# Altium schematic sheet Power_Sheet.SchDoc: Power Circuit
size 420 x 297 mm; Engineer: Zain Siddiqui; Revision: V1.0; SheetNumber: 4; SheetTotal: 8
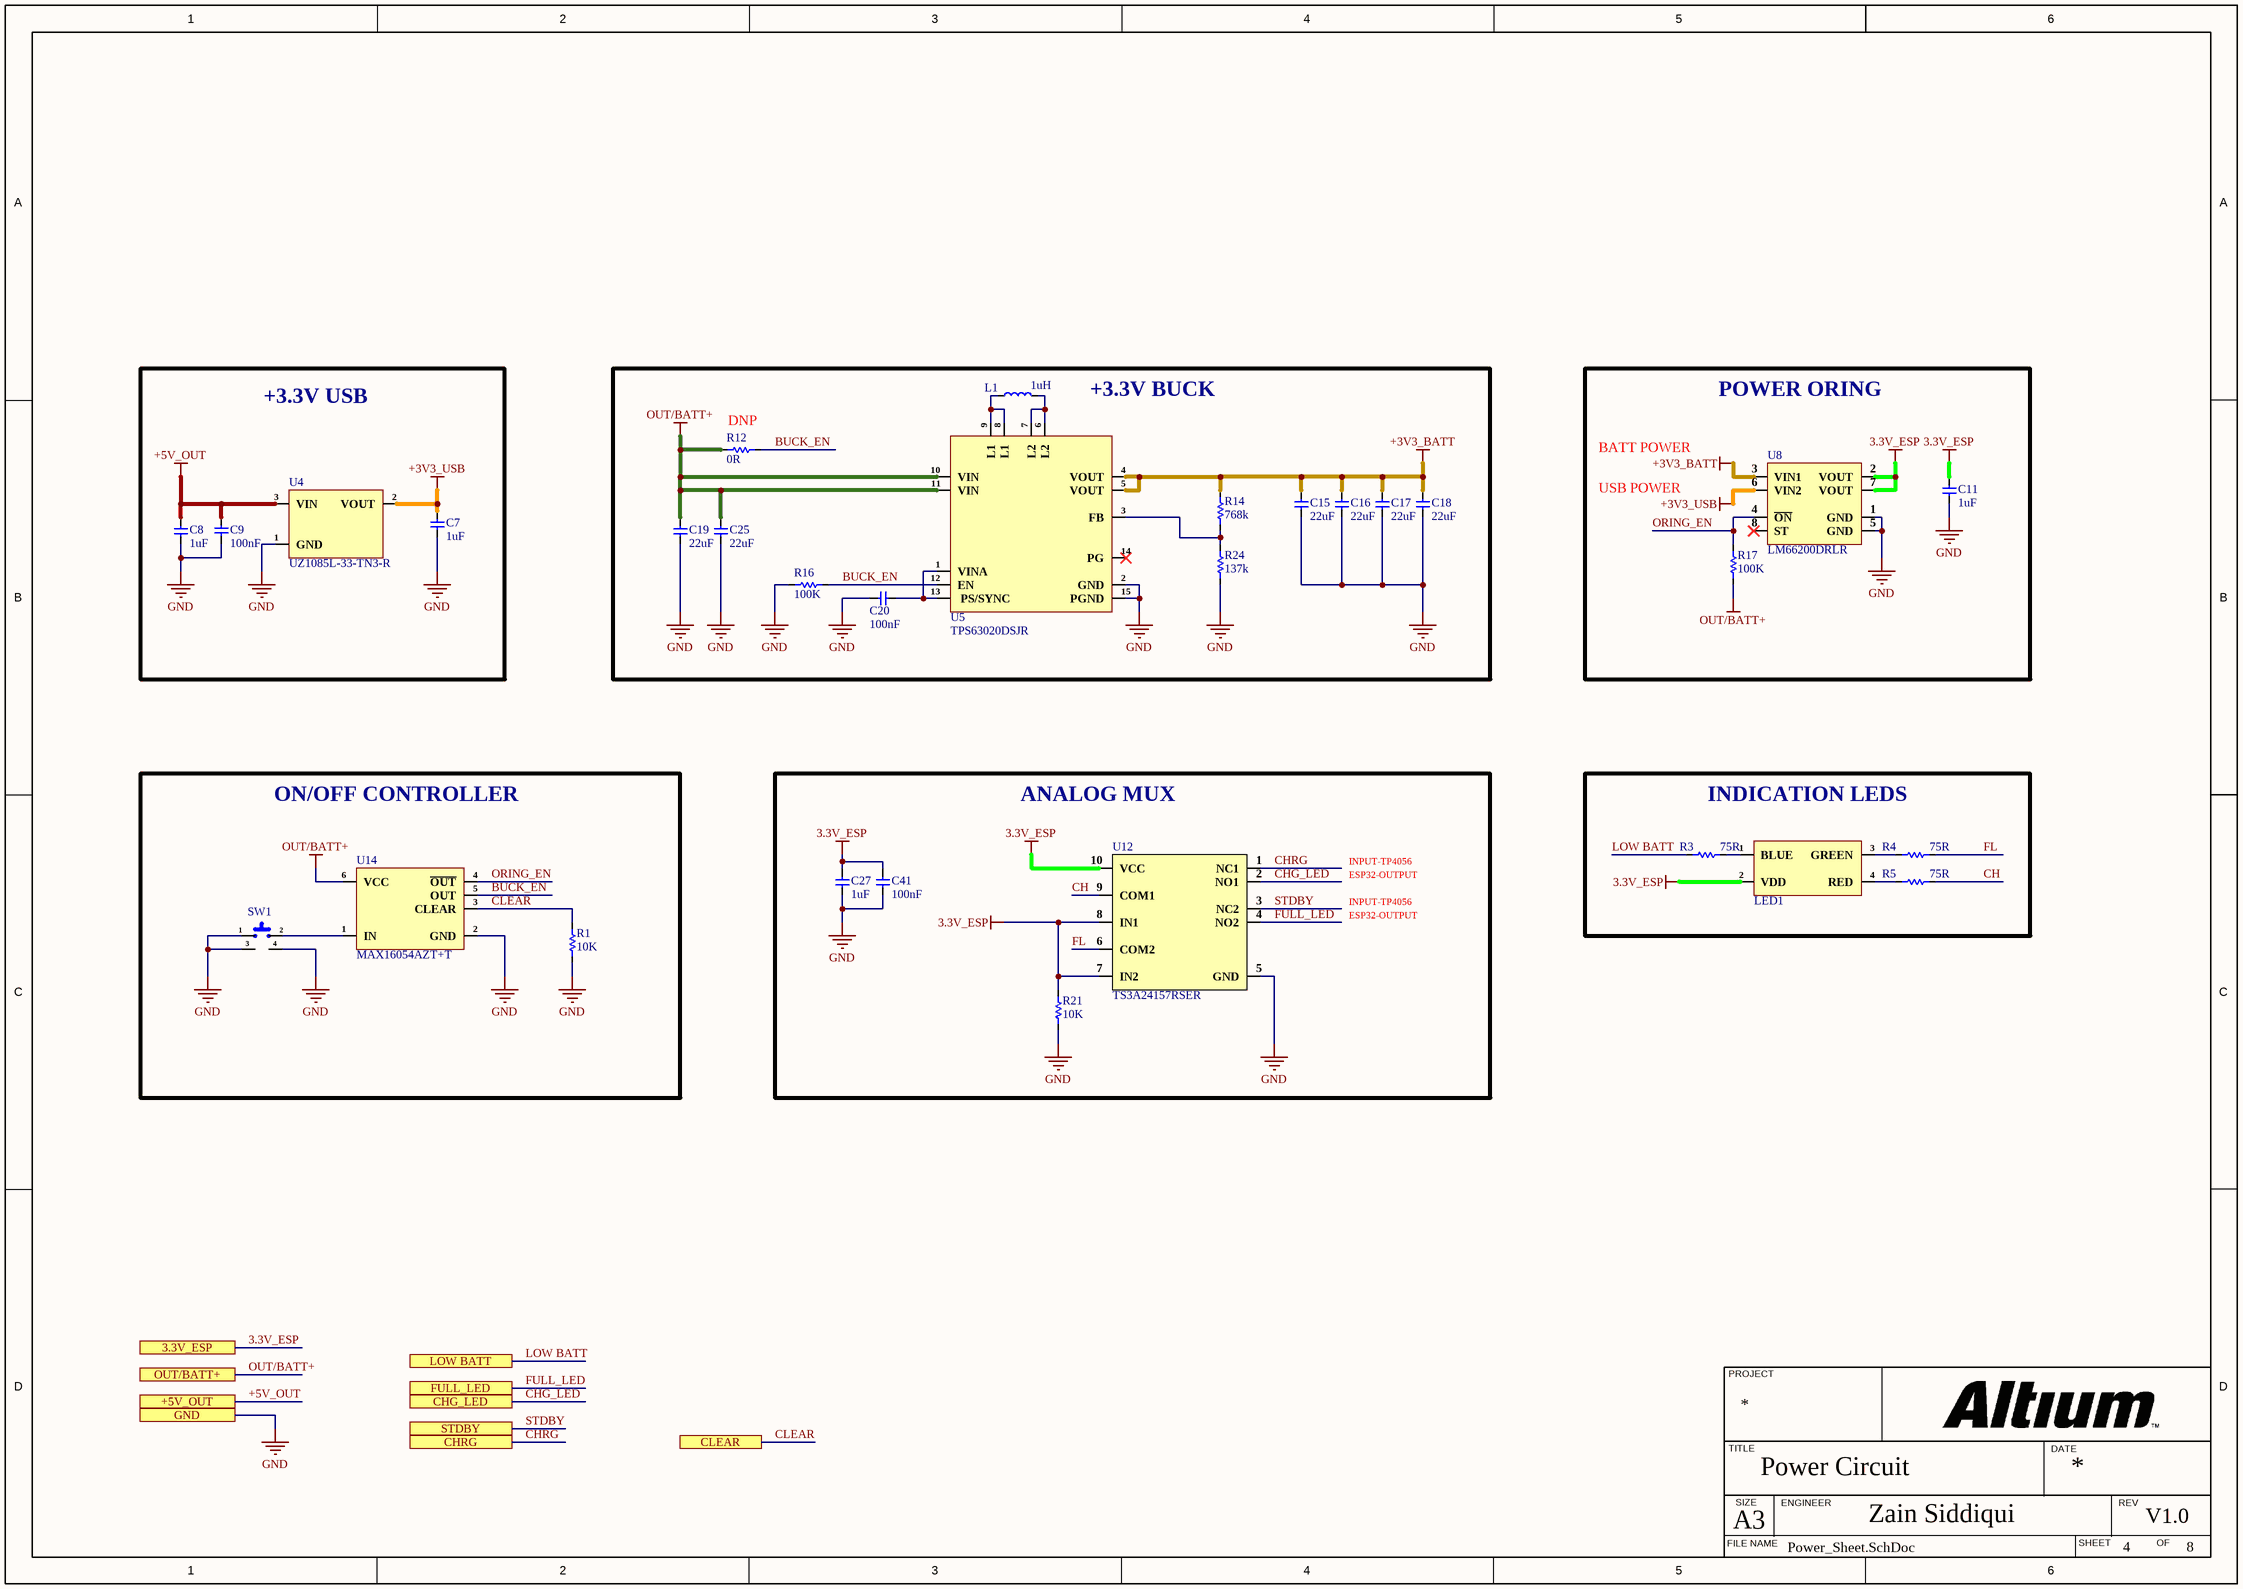
[diagram p0: Power_Sheet.SchDoc]

## Parts
C7  1uF  [Cap-0402]
C8  1uF  [Cap-0402]
C9  100nF  [cap-0402]
C11  1uF  [Cap-0402]
C15  22uF  [Cap-0805]
C16  22uF  [Cap-0805]
C17  22uF  [Cap-0805]
C18  22uF  [Cap-0805]
C19  22uF  [Cap-0805]
C20  100nF  [cap-0402]
C25  22uF  [Cap-0805]
C27  1uF  [Cap-0402]
C41  100nF  [cap-0402]
L1  1uH  [IND-1008 (2520 Metric)]
LED1  S4-3528RGBTA-A  [SMD3528-4P]  (value not drawn)
R1  10K  [Res-0402]
R3  75R  [Res-0402]
R4  75R  [Res-0402]
R5  75R  [Res-0402]
R12  0R  [Res-0402]  (no BOM)
R14  768k  [Res-0402]
R16  100K  [Res-0402]
R17  100K  [Res-0402]
R21  10K  [Res-0402]
R24  137k  [Res-0402]
SW1  TC-6615-9.5-260G  [TC-6615-9.5-260G]  (value not drawn)
U4  UZ1085L-33-TN3-R  [TO-252-2(DPAK)]
U5  TPS63020DSJR  [14-VSON (4x3)]
U8  LM66200DRLR  [SOT8]
U12  TS3A24157RSER  [UQFN-10(1.5x2)]
U14  MAX16054AZT+T  [TSOT-23-6]

## Blocks framed on the sheet
+3.3V USB: C7-C9 U4
+3.3V BUCK: C15-C20 C25 L1 R12 R14 R16 R24 U5
POWER ORING: C11 R17 U8
ON/OFF CONTROLLER: R1 SW1 U14
ANALOG MUX: C27 C41 R21 U12
INDICATION LEDS: LED1 R3-R5

## Ports
3.3V_ESP (see Top_Sheet[2B], BattCharging_Sheet[2D], Controller_Sheet[3D], Display_Sheet[1D], Ethernet_Sheet[4D], FuelGauge_Sheet[2C]), +5V_OUT (see Top_Sheet[2B], BattCharging_Sheet[2D], USB_Sheet[3C]), CHG_LED (see Top_Sheet[2B], Controller_Sheet[4D]), CHRG (see Top_Sheet[2B], BattCharging_Sheet[3D], Controller_Sheet[4D]), CLEAR (see Top_Sheet[2B], Controller_Sheet[4D]), FULL_LED (see Top_Sheet[2B], Controller_Sheet[4D]), GND (see Top_Sheet[2C], BattCharging_Sheet[2D], Controller_Sheet[3D], Display_Sheet[1D], Ethernet_Sheet[4D], FuelGauge_Sheet[2C], USB_Sheet[3C]), LOW BATT (see Top_Sheet[2C], Controller_Sheet[4D]), OUT/BATT+ (see Top_Sheet[2B], BattCharging_Sheet[2D], FuelGauge_Sheet[2C]), STDBY (see Top_Sheet[2B], BattCharging_Sheet[3D], Controller_Sheet[4D])

## Nets
3.3V_ESP: C11.2 C27.2 C41.2 LED1.2(VDD) R21.1 U8.2(VOUT) U8.7(VOUT) U12.7(IN2) U12.8(IN1) U12.10(VCC) ; port 3.3V_ESP
+3V3_BATT: C15.2 C16.2 C17.2 C18.2 R14.2 U5.4(VOUT) U5.5(VOUT) U8.3(VIN1)
+3V3_USB: C7.2 U4.2(VOUT) U8.6(VIN2)
+5V_OUT: C8.2 C9.1 U4.3(VIN) ; port +5V_OUT
GND: C7.1 C8.1 C9.2 C11.1 C15.1 C16.1 C17.1 C18.1 C19.1 C20.2 C25.1 C27.1 C41.1 R1.2 R16.1 R21.2 R24.1 SW1.1 SW1.3 SW1.4 U4.1(GND) U5.2(GND) U5.15(PGND) U8.1(GND) U8.5(GND) U12.5(GND) U14.2(GND) ; port GND
OUT/BATT+: C19.2 C25.2 R12.1 R17.1 U5.10(VIN) U5.11(VIN) U14.6(VCC) ; port OUT/BATT+
BUCK_EN: R12.2 R16.2 U5.12(EN) U14.5(OUT)
CH: R5.2 U12.9(COM1)
CHG_LED: U12.2(NO1) ; port CHG_LED
CHRG: U12.1(NC1) ; port CHRG
CLEAR: R1.1 U14.3(CLEAR) ; port CLEAR
FL: R4.2 U12.6(COM2)
FULL_LED: U12.4(NO2) ; port FULL_LED
LOW BATT: R3.1 ; port LOW BATT
ORING_EN: R17.2 U8.4(~{ON}) U14.4(~{OUT})
STDBY: U12.3(NC2) ; port STDBY
NetC20_1: C20.1 U5.1(VINA) U5.13(PS/SYNC)
NetL1_1: L1.1 U5.8(L1) U5.9(L1)
NetL1_2: L1.2 U5.6(L2) U5.7(L2)
NetLED1_1: LED1.1(BLUE) R3.2
NetLED1_3: LED1.3(GREEN) R4.1
NetLED1_4: LED1.4(RED) R5.1
NetR14_1: R14.1 R24.2 U5.3(FB)
NetSW1_2: SW1.2 U14.1(IN)

Not connected (* = marked no-connect by the designer): U5 14(PG)*; U8 8(ST)*

## Notes on the sheet
- (near R12) DNP
- BATT POWER
- USB POWER
- INPUT-TP4056
- ESP32-OUTPUT
- PROJECT
- TITLE
- DATE
- FILE NAME
- A3
- SIZE
- ENGINEER
- SHEET
- REV
- OF

## Library data of the parts
C7 = CC0402KRX5R6BB105: CAP CER 1UF 10V X5R 0402; Manufacturer: Yageo; Tolerance: 10%; Dissipation Factor: 15%; Item Type: Capacitor; Supplier 1: Mouser; Manufacturer Part Number: CC0402KRX5R6BB105; RoHS: Yes; Category: Ceramic Capacitors; Stock 1: 6711367; Pricing 1: 1=0.11000, 10=0.05500, 50=0.05500, 100=0.03300, 500=0.02700, 1000=0.02200, 2500=0.02100, 10000=0.01800 (USD); Mount: Surface Mount; Case/Package: 0402; Number of Pins: 2; Case Code (Metric): 1005; Case Code (Imperial): 0402; Min Operating Temperature: -55°C; Max Operating Temperature: 85°C; Capacitance: 1uF; Dielectric: X5R; Package Quantity: 1; Voltage Rating: 10V; Packaging: Tape and Reel; Voltage Rating (DC): 10V; Termination: SMD/SMT; Resistor Type: Ceramic; Series: CC; Construction: Flat; Length: 1mm; Width: 0.02inch; Height: 0.5mm; Thickness: 0.022inch; Depth: 0.5mm; Radiation Hardening: No; REACH SVHC: No SVHC; Lead Free: Lead Free; Halogen Free: Halogen Free; RoHS Compliant: Yes; ComponentLink1URL: https://datasheet.ciiva.com/176/upy-gphc-x5r-4v-to-50v-12-176704.pdf?src-supplier=Digi-Key; ComponentLink1Description: https://datasheet.ciiva.com/176/upy-gphc-x5r-4v-to-50v-12-176704.pdf?src-supplier=Digi-Key; ComponentLink2URL: https://datasheet.ciiva.com/176/mlccorderingcode-176705.pdf?src-supplier=Digi-Key; ComponentLink2Description: https://datasheet.ciiva.com/176/mlccorderingcode-176705.pdf?src-supplier=Digi-Key; ComponentLink3URL: https://datasheet.ciiva.com/176/mlccorderingcode-176706.pdf?src-supplier=Digi-Key; ComponentLink3Description: https://datasheet.ciiva.com/176/mlccorderingcode-176706.pdf?src-supplier=Digi-Key; Supplier Part Number 1: 603-CC402KRX5R6BB105; LCSC Part Number: C106254
C8 C11 C27 = CC0402KRX5R8BB105: CAP CER 1UF 25V X5R 0402; Manufacturer: Yageo; Tolerance: 10%; Supplier 1: Mouser; Manufacturer Part Number: CC0402KRX5R8BB105; RoHS: Yes; Category: Ceramic Capacitors; Stock 1: 91975; Pricing 1: 1=0.30000, 10=0.20400, 50=0.20400, 100=0.11600, 1000=0.07200, 10000=0.05900 (USD); Mount: Surface Mount; Case/Package: 0402; Case Code (Metric): 1005; Case Code (Imperial): 0402; Weight: 2.3E-05oz; Min Operating Temperature: -55°C; Max Operating Temperature: 85°C; Packaging: Tape and Reel; Capacitance: 1uF; Voltage Rating: 25V; Dielectric: X5R; Termination: SMD/SMT; Voltage Rating (DC): 25V; Package Quantity: 10000; Length: 0.039inch; Width: 0.02inch; Thickness: 0.022inch; Lead Free: Lead Free; Halogen Free: Halogen Free; RoHS Compliant: Yes; ComponentLink1URL: http://www.mouser.com/ds/2/447/Yageo_UPY-GP_NP0_16V-to-50V_9-358835.pdf?src-supplier=Mouser; ComponentLink1Description: http://www.mouser.com/ds/2/447/Yageo_UPY-GP_NP0_16V-to-50V_9-358835.pdf?src-supplier=Mouser; ComponentLink2URL: http://www.yageo.com/documents/recent/UPY-GPHC_X5R_4V-to-50V_25.pdf?src-supplier=Digi-Key; ComponentLink2Description: http://www.yageo.com/documents/recent/UPY-GPHC_X5R_4V-to-50V_25.pdf?src-supplier=Digi-Key; ComponentLink3URL: https://4donline.ihs.com/images/VipMasterIC/IC/YAGO/YAGO-S-A0006851646/YAGO-S-A0006851646-1.pdf?hkey=6D3A4C79FDBF58556ACFDE234799DDF0&src-supplier=Newark; ComponentLink3Description: https://4donline.ihs.com/images/VipMasterIC/IC/YAGO/YAGO-S-A0006851646/YAGO-S-A0006851646-1.pdf?hkey=6D3A4C79FDBF58556ACFDE234799DDF0&src-supplier=Newark; Supplier Part Number 1: 603-CC402KRX5R8BB105; LCSC Part Number: C326568
C9 C20 C41 = C1005X7R1H104KT000F: CAP CER 0.1UF 50V X7R 0402; Manufacturer: TDK; Tolerance: 10%; Voltage: 25V; Item Type: Capacitor; Supplier 1: Avnet; Manufacturer Part Number: C1005X7R1H104KT000F; RoHS: No; Category: Ceramic Capacitors; Dielectric: X7R; Supplier Part Number 1: C1005X7R1H104KT000F; LCSC Part Number: C361198; ComponentLink1Description: LCSC; ComponentLink1URL: https://www.lcsc.com/product-detail/Multilayer-Ceramic-Capacitors-MLCC-SMD-SMT_TDK-C1005X7R1H104KT000F_C361198.html
C15-C19 C25 = C2012X5R1V226MT000E: CAP CER 22UF 35V X5R 0805; Manufacturer: TDK Corporation; Item Type: Capacitor; Manufacturer Part Number: C2012X5R1V226MT000E; Package: 0805; ComponentLink1Description: LCSC; ComponentLink1URL: https://www.lcsc.com/product-detail/Multilayer-Ceramic-Capacitors-MLCC-SMD-SMT_TDK-C2012X5R1V226M125AC_C2179409.html; LCSC Part Number: C338080
L1 = DFE252012P-1R0M=P2: FIXED IND 1UH 3.2A 0.042OHM SMD; Manufacturer: Murata; Item Type: Inductor; Core Material: Ferrite; Current Rating: 4.3A; Shielding: Shielded; DC Resistance (DCR): 42mR; Test Frequency: 1MHz; Tolerance: 20%; Supplier: Future Electronics; LCSC Part Number: C882955; Manufacturer Part Number: DFE252012P-1R0M=P2; RoHS: Yes; Stock: 30000; Pricing: 3000=0.103, 6000=0.1, 9000=0.0987, 12000=0.0976, 15000=0.0942 (USD); Mounting Technology: Surface Mount; Case/Package: 1008; Case Code (Metric): 2520; Case Code (Imperial): 1008; Min Operating Temperature: -40°C; Max Operating Temperature: 125°C; Value: 1uH; Packaging: Cut Tape; Max DC Current: 3.2A; Series: DFE252012P; Inductance Tolerance: 20%; RMS Current (Irms): 3.2A; Saturation Current: 4.3A; ESR: 42mR; Length: 0.098inch; Width: 0.079inch; Height: 1.2mm; Height - Seated (Max): 0.039inch; Depth: 2mm; RoHS Compliant: Yes; ComponentLink1URL: http://www.farnell.com/datasheets/2550134.pdf?src-supplier=Farnell; ComponentLink1Description: http://www.farnell.com/datasheets/2550134.pdf?src-supplier=Farnell; ComponentLink2URL: https://www.murata.com/~/media/webrenewal/products/inductor/chip/tokoproducts/wirewoundmetalalloychiptype/m_dfe252012p.ashx?src-supplier=Digikey; ComponentLink2Description: https://www.murata.com/~/media/webrenewal/products/inductor/chip/tokoproducts/wirewoundmetalalloychiptype/m_dfe252012p.ashx?src-supplier=Digikey; ComponentLink3URL: http://www.murata.com/~/media/webrenewal/products/inductor/chip/tokoproducts/wirewoundmetalalloychiptype/m_dfe252012p.ashx?src-supplier=Digikey; ComponentLink3Description: http://www.murata.com/~/media/webrenewal/products/inductor/chip/tokoproducts/wirewoundmetalalloychiptype/m_dfe252012p.ashx?src-supplier=Digikey; ComponentLink4URL: http://www.toko.co.jp/products/pdf/inductors/dfe252012p.pdf?src-supplier=Avnet; ComponentLink4Description: http://www.toko.co.jp/products/pdf/inductors/dfe252012p.pdf?src-supplier=Avnet
LED1 = S4-3528RGBTA-A: SMD3528-4P LED Indication - Discrete RoHS; Manufacturer: TUOZHAN; Item Type: RGB LED; Manufacturer Part Number: S4-3528RGBTA-A; LCSC Part Number: C2827321; Package: SMD3528-4P; ComponentLink1Description: LCSC Link; ComponentLink1URL: https://www.lcsc.com/product-detail/C2827321.html?s_z=n_RGB
R1 R21 = RC0402FR-0710KL: RES 10K OHM 1% 1/16W 0402; Manufacturer: Yageo; Resistance: 10kR; Voltage Rating (DC): 50V; Temperature Coefficient: 100ppm/°C; Power Rating: 62.5mW; Max Power Dissipation: 63mW; Item Type: Resistor; Supplier 1: Mouser; Manufacturer Part Number: RC0402FR-0710KL; RoHS: Yes; Category: Chip SMD Resistors; Stock 1: 18648329; Pricing 1: 1=0.10000, 10=0.01400, 50=0.01400, 100=0.00500, 1000=0.00300, 10000=0.00200 (USD); Case/Package: 0402; Number of Pins: 2; Case Code (Imperial): 0402; Case Code (Metric): 1005; Min Operating Temperature: -55°C; Max Operating Temperature: 155°C; Resistor Type: Thick Film; Tolerance: 1%; Packaging: Tape and Reel; Voltage Rating: 50V; Termination: SMD/SMT; Working Voltage: 50V; Number of Terminations: 2; Features: Moisture Resistant; Series: RC; Resistance Tolerance: 1%; Construction: Rectangular; Length: 1mm; Width: 0.5mm; Height: 0.32mm; Depth: 0.5mm; Lead Pitch: 0.2mm; REACH SVHC: No SVHC; Lead Free: Lead Free; RoHS Compliant: Yes; Military Standard: Not; ComponentLink1URL: https://datasheet.ciiva.com/7660/38568-7660787.pdf?src-supplier=Element14; ComponentLink1Description: https://datasheet.ciiva.com/7660/38568-7660787.pdf?src-supplier=Element14; ComponentLink2URL: https://datasheet.ciiva.com/7849/1686128-7849814.pdf?src-supplier=Element14; ComponentLink2Description: https://datasheet.ciiva.com/7849/1686128-7849814.pdf?src-supplier=Element14; ComponentLink3URL: https://datasheet.ciiva.com/7983/1018594-7983486.pdf?src-supplier=Element14; ComponentLink3Description: https://datasheet.ciiva.com/7983/1018594-7983486.pdf?src-supplier=Element14; ComponentLink4URL: https://datasheet.ciiva.com/22747/1018594-22747512.pdf?src-supplier=Element14; ComponentLink4Description: https://datasheet.ciiva.com/22747/1018594-22747512.pdf?src-supplier=Element14; ComponentLink5URL: https://datasheet.ciiva.com/12667/pyu-rc0402-51-rohs-l-6-r-12667067.pdf?src-supplier=Mouser; ComponentLink5Description: https://datasheet.ciiva.com/12667/pyu-rc0402-51-rohs-l-6-r-12667067.pdf?src-supplier=Mouser; ComponentLink6URL: https://datasheet.ciiva.com/7849/1784430-7849813.pdf?src-supplier=Element14; ComponentLink6Description: https://datasheet.ciiva.com/7849/1784430-7849813.pdf?src-supplier=Element14; ComponentLink7URL: https://datasheet.ciiva.com/7849/1784430-7849815.pdf?src-supplier=Element14; ComponentLink7Description: https://datasheet.ciiva.com/7849/1784430-7849815.pdf?src-supplier=Element14; Supplier Part Number 1: 603-RC0402FR-0710KL; LCSC Part Number: C60490
R3-R5 = RC0402FR-0775RL: 75Ω ±1% 62.5mW 0402 Thick Film Resistor; Manufacturer: YAGEO; Item Type: SMD Resistor; Manufacturer Part Number: RC0402FR-0775RL; LCSC Part Number: C114757; Package: 0402; ComponentLink1Description: LCSC Link; ComponentLink1URL: https://www.lcsc.com/product-detail/C114757.html
R12 = RC0402FR-070RL: RES 0 OHM JUMPER 1/16W 0402; Manufacturer: Yageo; Item Type: Resistors; Tolerance: 1%; Power Rating: 62.5mW; Voltage Rating: 50V; Temperature Coefficient: 200ppm/°C; Max Power Dissipation: 63mW; Supplier 1: Mouser; Manufacturer Part Number: RC0402FR-070RL; RoHS: Yes; Stock 1: 8556842; Pricing 1: 1=0.10000, 10=0.01400, 50=0.01400, 100=0.00600, 1000=0.00300, 5000=0.00200, 10000=0.00100 (USD); Mount: Surface Mount; Case/Package: 0402; Contact Plating: Tin,Matte; Case Code (Imperial): 0402; Case Code (Metric): 1005; Size Code: 0402; Min Operating Temperature: -55°C; Max Operating Temperature: 155°C; Resistance: 0R; Resistor Type: Thick Film; Packaging: Tape and Reel; Termination: SMD/SMT; Features: Moisture Resistant; Series: RC; Number of Terminations: 2; Length: 1mm; Width: 0.5mm; Height: 0.35mm; Radiation Hardening: No; Lead Free: Lead Free; RoHS Compliant: Yes; ComponentLink1URL: https://datasheet.ciiva.com/8896/pyu-rc0402-51-rohs-l-6-8896149.pdf?src-supplier=Avnet; ComponentLink1Description: https://datasheet.ciiva.com/8896/pyu-rc0402-51-rohs-l-6-8896149.pdf?src-supplier=Avnet; ComponentLink2URL: https://datasheet.ciiva.com/16790/pyu-rc0402-51-rohs-l-6-r-16790444.pdf?src-supplier=Future+Electronics; ComponentLink2Description: https://datasheet.ciiva.com/16790/pyu-rc0402-51-rohs-l-6-r-16790444.pdf?src-supplier=Future+Electronics; Supplier Part Number 1: 603-RC0402FR-070RL; LCSC Part Number: C106231
R14 = AC0402FR-07768KL: 62.5mW Thick Film Resistor 50V ±100ppm/℃ ±1% 768kΩ 0402 Chip Resistor - Surface Mount ROHS; Manufacturer: YAGEO; Manufacturer Part Number: AC0402FR-07768KL; LCSC Part Number: C227223; Item Type: Resistor; Package: 0402; ComponentLink1Description: LCSC Link; ComponentLink1URL: https://lcsc.com/product-detail/Chip-Resistor-Surface-Mount_YAGEO-AC0402FR-07768KL_C227223.html
R16 R17 = RT0402BRD07100KL: RES SMD 100K OHM 0.1% 1/16W 0402; Manufacturer: Yageo; Voltage Rating (DC): 50V; Item Type: Resistor; Supplier: Digikey; Supplier Part Number: YAG1343CT-ND; Manufacturer Part Number: RT0402BRD07100KL; RoHS: Yes; Category: Chip SMD Resistors; Stock: 62932; Pricing: 1=0.16, 10=0.121, 50=0.0958, 100=0.0859, 500=0.0654, 1000=0.0578, 5000=0.04283 (USD); ComponentLink1URL: https://datasheet.ciiva.com/12724/pyu-rt-1-to-0-05-rohs-l-4-12724954.pdf?src-supplier=Mouser; ComponentLink1Description: https://datasheet.ciiva.com/12724/pyu-rt-1-to-0-05-rohs-l-4-12724954.pdf?src-supplier=Mouser; LCSC Part Number: C852472
R24 = FRC0402F1373TS: 62.5mW Thick Film Resistor 50V ±100ppm/℃ ±1% 137kΩ 0402 Chip Resistor - Surface Mount ROHS; Manufacturer: FOJAN; Manufacturer Part Number: FRC0402F1373TS; LCSC Part Number: C5153963; Item Type: Resistor; Package: 0402; ComponentLink1Description: LCSC Link; ComponentLink1URL: https://lcsc.com/product-detail/Chip-Resistor-Surface-Mount_FOJAN-FRC0402F1373TS_C5153963.html
SW1 = TC-6615-9.5-260G: Tactile Switch SPST 260gf 9.5mm 6mm x 6mm Through Hole, Right Angle; Manufacturer: HCTL; Manufacturer Part Number: TC-6615-9.5-260G; LCSC Part Number: C2845278; Item Type: Tactile Switch; Package: Through Hole,Right Angle-4P,6x6mm; ComponentLink1Description: LCSC Link; ComponentLink1URL: https://www.lcsc.com/product-detail/C2845278.html
U4 = UZ1085L-33-TN3-R: 72dB@(120Hz) Positive Fixed 3.3V TO-252-2(DPAK) Voltage Regulators - Linear, Low Drop Out (LDO) Regulators RoHS; Manufacturer: UTC; Item Type: Linear Regulator; Manufacturer Part Number: UZ1085L-33-TN3-R; LCSC Part Number: C125622; Package: TO-252-2(DPAK); ComponentLink1Description: LCSC Link; ComponentLink1URL: https://www.lcsc.com/product-detail/C125622.html
U5 = TPS63020DSJR: IC REG BUCK-BST ADJ 3.5A 14VSON; Manufacturer: Texas Instruments; Min Supply Voltage: 1.8V; Number of Outputs: 1; Output Voltage: 5.5V; Output Current: 3A; Efficiency: 96%; Switching Frequency: 2.4MHz; Min Output Voltage: 1.2V; Synchronous Rectifier: Yes; Quiescent Current: 50uA; Topology: Buck-Boost; Output Type: Adjustable; Output Configuration: Positive; Supplier: Mouser; Supplier Part Number: 595-TPS63020DSJR; Manufacturer Part Number: TPS63020DSJR; RoHS: Yes; Category: Voltage Regulators - Switching; Stock: 18181; Pricing: 1=2.8, 10=2.43, 50=2.43, 100=2.07, 1000=1.46, 10000=1.36 (USD); Mounting Technology: Surface Mount; Case/Package: VSON; Pins: 14; Min Operating Temperature: -40°C; Max Operating Temperature: 85°C; Package Quantity: 3000; Packaging: Tape and Reel; Min Input Voltage: 1.8V; Max Output current: 3A; Max Supply Voltage: 5.5V; Max Output Voltage: 5.5V; Operating Supply Voltage: 5.5V; Series: -; Supply Current: 50uA; Reach SVHC Compliant: No; Lead Free: Lead Free; RoHS Compliant: Yes; ComponentLink1URL: https://datasheet.ciiva.com/29733/tps63021-29733058.pdf?src-supplier=Digi-Key; ComponentLink1Description: https://datasheet.ciiva.com/29733/tps63021-29733058.pdf?src-supplier=Digi-Key; ComponentLink2URL: https://datasheet.ciiva.com/29733/tps63020-29733142.pdf?src-supplier=Digi-Key; ComponentLink2Description: https://datasheet.ciiva.com/29733/tps63020-29733142.pdf?src-supplier=Digi-Key; ComponentLink3URL: https://datasheet.ciiva.com/3221/tps63020-3221509.pdf?src-supplier=Avnet; ComponentLink3Description: https://datasheet.ciiva.com/3221/tps63020-3221509.pdf?src-supplier=Avnet; LCSC Part Number: C15483; Item Type: IC
U8 = LM66200DRLR: 1.6V to 5V, 2.5A dual ideal diodes with automatic switching function; Manufacturer: TI; Item Type: ORING IC; Manufacturer Part Number: LM66200DRLR; LCSC Part Number: C3235556; Package: SOT-583; ComponentLink1Description: LCSC Link; ComponentLink1URL: https://www.lcsc.com/product-detail/C3235556.html
U12 = TS3A24157RSER: IC SWITCH DUAL SPDT 10UQFN; Manufacturer: TI; Polarity: Non-Inverting; Max Supply Current: 25nA; Operating Supply Voltage: 3V; Number of Outputs: 4; Number of Inputs: 2; Supply Type: Single; Bandwidth: 50MHz; Turn-On Delay Time: 35ns; Low Level Output Current: 300mA; Operating Supply Current: 15nA; On-State Resistance: 600mR; Min Supply Voltage: 1.65V; Turn-Off Delay Time: 25ns; Max Supply Voltage: 3.6V; Item Type: MUX/DEMUX; RoHS Compliant: Yes; Max Operating Temperature: 85°C; Series: -; Radiation Hardening: No; Width: 1.55mm; Number of Pins: 10; REACH SVHC: No SVHC; Contact Plating: Gold; Length: 2.05mm; Number of Channels: 2; Min Operating Temperature: -40°C; Lead Free: Lead Free; Mount: Surface Mount; Packaging: Tape and Reel; Weight: 0.000247oz; Package Quantity: 1; Case/Package: QFN; High Level Output Current: 300mA; Height: 0.55mm; Throw Configuration: SPDT; Manufacturer Part Number: TS3A24157RSER; LCSC Part Number: C575568; Package: UQFN-10(1.5x2); ComponentLink1Description: LCSC Link; ComponentLink1URL: https://www.lcsc.com/product-detail/C575568.html
U14 = MAX16054AZT+T: IC CNTRLR ON/OFF W/DEB TSOT23-6; Manufacturer: Maxim; Max Power Dissipation: 727W; Max Supply Voltage: 5.5V; Min Supply Voltage: 2.7V; Number of Voltages Monitored: 1; Undervoltage Threshold: 1.8V; Operating Supply Current: 7uA; Watchdog Timer: No; Output Type: PUSH-PULL; Supplier 1: Arrow Electronics; Manufacturer Part Number: MAX16054AZT+T; RoHS: Yes; Category: Interface ICs; Stock 1: 3; Pricing 1: 1=2.99700 (USD); Mounting Technology: Surface Mount; Case/Package: SOT-23-6; Pins: 6; Contact Plating: Tin,Matte; Min Operating Temperature: -40°C; Max Operating Temperature: 125°C; Packaging: Tape and Reel; Package Quantity: 1; Series: -; Length: 4mm; Width: 4mm; Height: 0.73mm; Radiation Hardening: No; RoHS Compliant: Yes; ComponentLink1URL: https://datasheet.ciiva.com/4901/max16054-83881-4901086.pdf?src-supplier=Mouser; ComponentLink1Description: https://datasheet.ciiva.com/4901/max16054-83881-4901086.pdf?src-supplier=Mouser; ComponentLink2URL: https://datasheet.ciiva.com/1784/max16054-1784560.pdf?src-supplier=Digi-Key; ComponentLink2Description: https://datasheet.ciiva.com/1784/max16054-1784560.pdf?src-supplier=Digi-Key; ComponentLink3URL: https://datasheet.ciiva.com/14247/max16054-14247770.pdf?src-supplier=Avnet; ComponentLink3Description: https://datasheet.ciiva.com/14247/max16054-14247770.pdf?src-supplier=Avnet; ComponentLink4URL: https://datasheet.ciiva.com/1784/max16054-1784561.pdf?src-supplier=Digi-Key; ComponentLink4Description: https://datasheet.ciiva.com/1784/max16054-1784561.pdf?src-supplier=Digi-Key; ComponentLink5URL: https://datasheet.ciiva.com/1784/max16054-1784562.pdf?src-supplier=Digi-Key; ComponentLink5Description: https://datasheet.ciiva.com/1784/max16054-1784562.pdf?src-supplier=Digi-Key; Supplier Part Number 1: MAX16054AZT+T; LCSC Part Number: C79401; Item Type: IC